# Altium schematic sheet Sheet1.SCHDOC
size 279 x 215 mm; SheetNumber: 1; SheetTotal: 1; DocumentName: Sheet1.SCHDOC
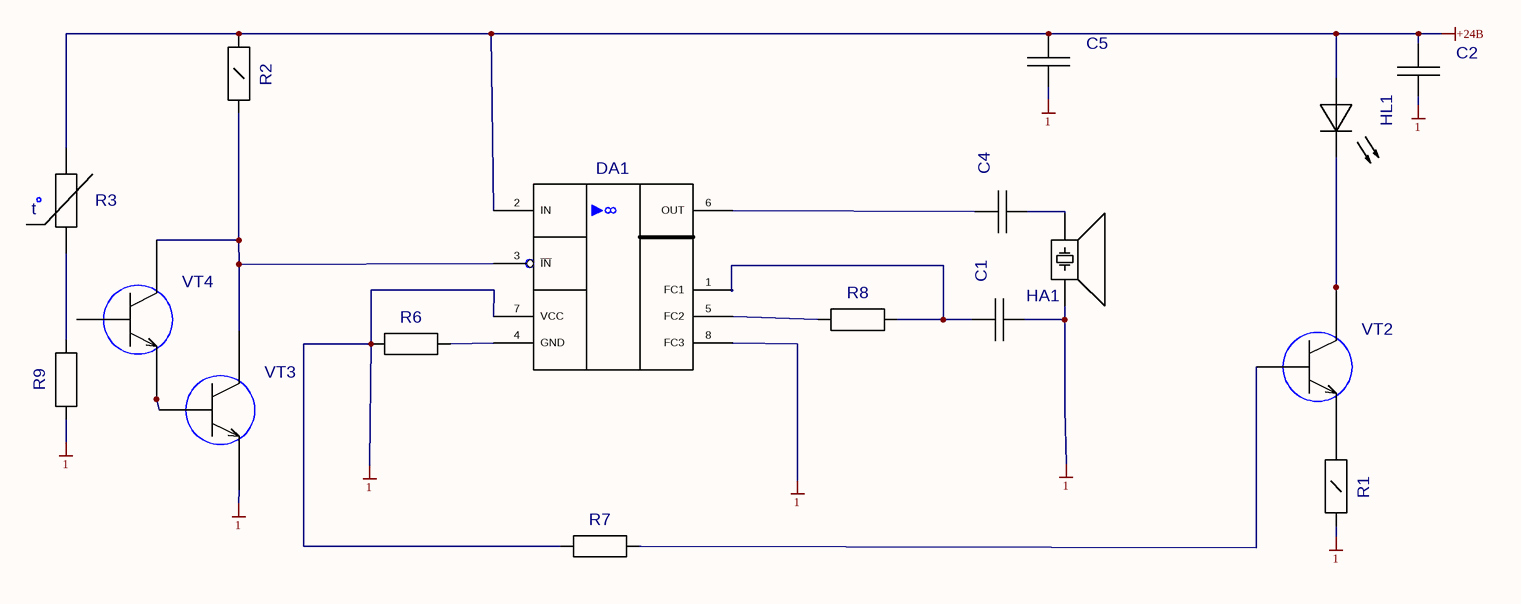
[diagram p0: Sheet1.SCHDOC]

## Parts
C1  B32921-C3103-0,01UF  [B32921(13X4)]  (value not drawn)
C2  B32921-C3103-0,01UF  [B32921(13X4)]  (value not drawn)
C4  B32921-C3103-0,01UF  [B32921(13X4)]  (value not drawn)
C5  B32921-C3103-0,01UF  [B32921(13X4)]  (value not drawn)
DA1  К153УД1А  [DIP8_300  ]  (value not drawn)
HA1  ЗП-3  [ЗП-1]  (value not drawn)
HL1  AL307  [AL307]  (value not drawn)
R1  C2-33H-0.25W_OLD_UGO  [C2-33H-0.25W]  (value not drawn)
R2  C2-33H-0.25W_OLD_UGO  [C2-33H-0.25W]  (value not drawn)
R3  B57861S0103F040  [B57861]  (value not drawn)
R6  С2-33Н-0,25 ВТ  [C2-33H-0.25W]  (value not drawn)
R7  С2-33Н-0,25 ВТ  [C2-33H-0.25W]  (value not drawn)
R8  С2-33Н-0,25 ВТ  [C2-33H-0.25W]  (value not drawn)
R9  С2-33Н-0,25 ВТ  [C2-33H-0.25W]  (value not drawn)
VT2  2N4401  [TO-92-1]  (value not drawn)
VT3  2N4401  [TO-92-1]  (value not drawn)
VT4  2N4401  [TO-92-1]  (value not drawn)

## Nets
1: C1.2 C2.2 C5.2 DA1.7(VCC) DA1.8(FC3) HA1.1 R1.2 R6.1(I/O0) R7.1(I/O0) R9.1(I/O0) VT3.1(E)
+24B: C2.1 C5.1 DA1.2(IN) HL1.2(I/O2) R2.1 R3.2
NetC1_1: C1.1 DA1.1(FC1) R8.2(I/O1)
NetC4_1: C4.1 DA1.6(OUT)
NetC4_2: C4.2 HA1.2
NetDA1_3: DA1.3(~{IN}) R2.2 VT3.3(K) VT4.3(K)
NetDA1_4: DA1.4(GND) R6.2(I/O1)
NetDA1_5: DA1.5(FC2) R8.1(I/O0)
NetHL1_1: HL1.1(I/O1) VT2.3(K)
NetR1_1: R1.1 VT2.1(E)
NetR3_1: R3.1 R9.2(I/O1)
NetR7_2: R7.2(I/O1) VT2.2(B)
NetVT3_2: VT3.2(B) VT4.1(E)

Not connected (* = marked no-connect by the designer): VT4 2(B)

## Notes on the sheet
- (in symbol B57861S0103F040) t

## Library data of the parts
R1 R2 = C2-33H-0.25W_OLD_UGO: Autor: pcbdesigner.ru; Value: *
C1 C2 C4 C5 = B32921-C3103-0,01UF: Value: *
DA1 = К153УД1А: Value: *
HA1 = ЗП-3: Value: *
HL1 = AL307: Value: *
R3 = B57861S0103F040: Value: *; Author: pcbdesigner.ru
R6-R9 = С2-33Н-0,25 ВТ: Value: *
VT2-VT4 = 2N4401: Value: *